# Altium project diff_curr_to_S_E_volt_with_second_order_LP_filter.PrjPcb
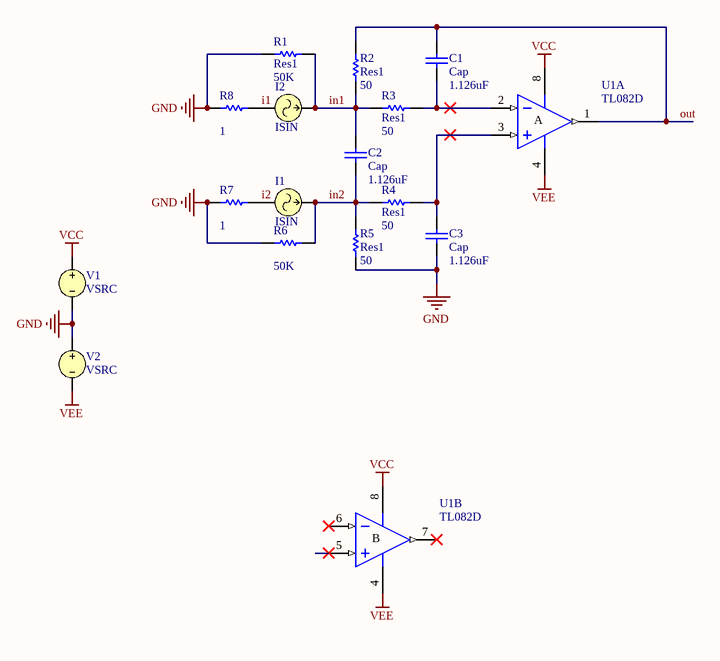
[diagram p0: diff_curr_to_S_E_volt_with_LP_filter.SchDoc]
1 sheet, 16 parts. Net scope: global (net labels, ports and power ports of the same name join across sheets).

## Sheet diff_curr_to_S_E_volt_with_LP_filter.SchDoc
size A4

### Parts
C1  Cap  value 1.126uF  [RAD-0.3]
C2  Cap  value 1.126uF  [RAD-0.3]
C3  Cap  value 1.126uF  [RAD-0.3]
I1  ISIN
I2  ISIN
R1  Res1  value 50K  [AXIAL-0.3]
R2  Res1  value 50  [AXIAL-0.3]
R3  Res1  value 50  [AXIAL-0.3]
R4  Res1  value 50  [AXIAL-0.3]
R5  Res1  value 50  [AXIAL-0.3]
R6  value 50K  [AXIAL-0.3]  (hidden comment: Res1)
R7  value 1  [AXIAL-0.3]  (hidden comment: Res1)
R8  value 1  [AXIAL-0.3]  (hidden comment: Res1)
U1  TL082D  [D008_L]  (parts A,B of 2)
V1  VSRC
V2  VSRC

### Nets
GND: C3.1 R1.2 R5.1 R6.2 R7.2 R8.2 V1.2 V2.1
VCC: U1.8(V+) V1.1
VEE: U1.4(V-) V2.2
i1: I2.1 R8.1
i2: I1.1 R7.1
in1: C2.1 I2.2 R1.1 R2.1 R3.1
in2: C2.2 I1.2 R4.1 R5.2 R6.1
out: C1.2 R2.2 U1.1(OUT)
NetC1_1: C1.1 R3.2 U1.2(IN-)
NetC3_2: C3.2 R4.2 U1.3(IN+)

Not connected (* = marked no-connect by the designer): U1 5(IN+)* 6(IN-)* 7(OUT)*

### Notes on the sheet
- (in symbol TL082D, part A) A
- (in symbol TL082D, part B) B

### Library data of the parts
C1-C3 = Cap: Capacitor; Published: 8-Jun-2000; LatestRevisionDate: 17-Jul-2002; LatestRevisionNote: Re-released for DXP Platform.; PackageReference: RAD-0.3; Publisher: Altium Limited; PackageDescription: Radial Cap, Thru-Hole; 2 Leads; 0.3 in Pin Spacing
I1 I2 = ISIN: Sinusoidal Current Source; Published: 8-Jun-2000; LatestRevisionDate: 15-Nov-2004; LatestRevisionNote: Corrected Netlist.; PackageReference: Not Applicable; Publisher: Altium Limited
R1-R8 = Res1: Resistor; Published: 8-Jun-2000; LatestRevisionDate: 17-Jul-2002; LatestRevisionNote: Re-released for DXP Platform.; PackageReference: AXIAL-0.3; Publisher: Altium Limited; PackageDescription: Axial Device, Thru-Hole; 2 Leads; 0.3 in Pin Spacing
U1 = TL082D: JFET-Input Operational Amplifier; Published: 16-Jan-2001; LatestRevisionDate: 13-Apr-2006; LatestRevisionNote: IPC-7351 Footprint Added.; DatasheetVersion: Feb-1999; PackageVersion: Jan-1998; PackageReference: D008; Publisher: Altium Limited; PackageDescription: 8-Pin Small Outline Integrated Circuit 1.27 mm Pitch; Code_IPC: SOIC127P600-8; ComponentLink1Description: Manufacturer Link; ComponentLink1URL: http://www.ti.com/; ComponentLink2Description: Datasheet; ComponentLink2URL: http://www-s.ti.com/sc/ds/tl082.pdf
V1 V2 = VSRC: Voltage Source; Note: PCB Footprint - Not required; Value: 15V; Published: 8-Jun-2000; LatestRevisionDate: 17-Jul-2002; LatestRevisionNote: Re-released for DXP Platform.; PackageReference: Not Applicable; Publisher: Altium Limited